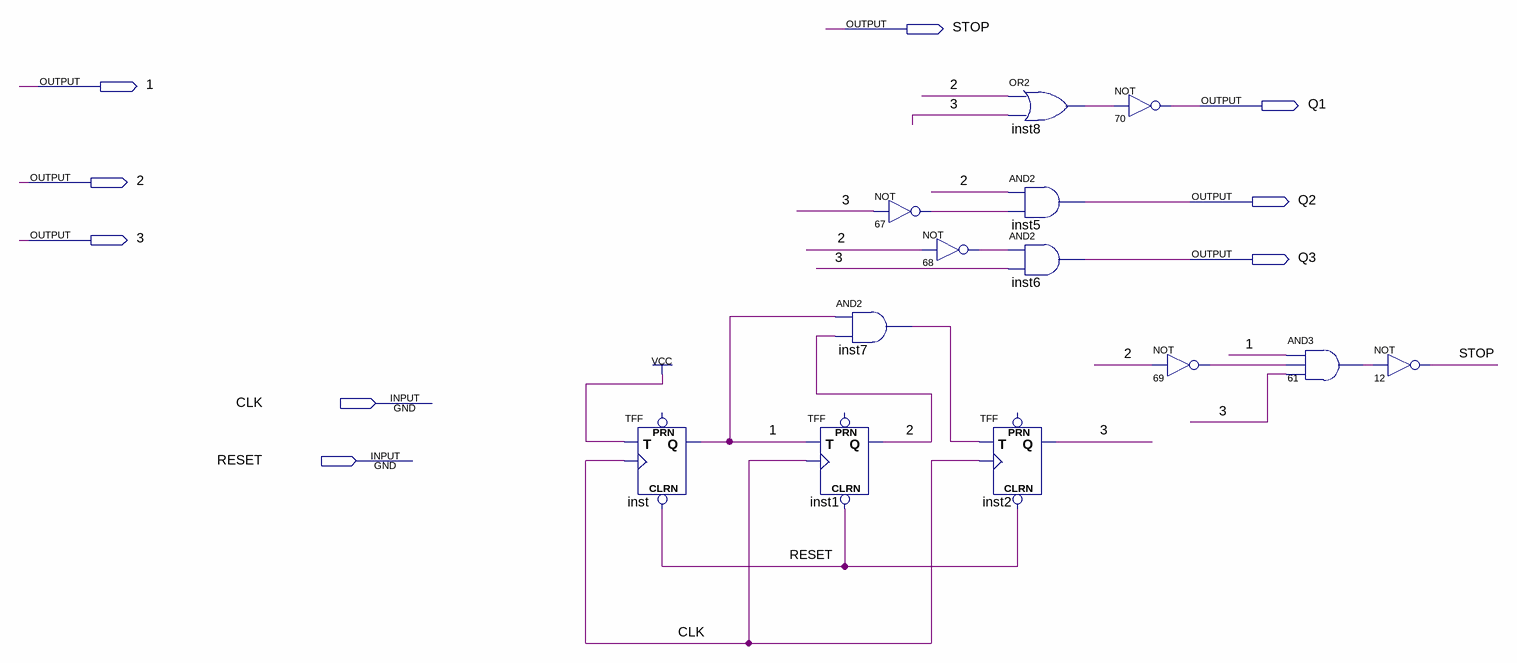
[diagram p0: schematic sheet]
// Quartus schematic proba_2des.bdf as structural Verilog: 13 symbols, 9 pins
module proba_2des (
  input  CLK,
  input  RESET,
  output STOP,
  output \1 ,
  output Q1,
  output \2 ,
  output Q2,
  output \3 ,
  output Q3
);

  wire inst7_out, inst8_out, n61_out, n67_out, n68_out, n69_out;

  TFF inst (.CLRN(RESET), .T(1'b1), .CLK(CLK), .Q(\1 ));  // open: PRN
  and inst7 (inst7_out, \1 , \2 );
  TFF inst1 (.CLRN(RESET), .T(\1 ), .CLK(CLK), .Q(\2 ));  // open: PRN
  not u_67 (n67_out, \3 );
  not u_68 (n68_out, \2 );
  TFF inst2 (.CLRN(RESET), .T(inst7_out), .CLK(CLK), .Q(\3 ));  // open: PRN
  or inst8 (inst8_out, \2 , \3 );
  and inst5 (Q2, \2 , n67_out);
  and inst6 (Q3, n68_out, \3 );
  not u_70 (Q1, inst8_out);
  not u_69 (n69_out, \2 );
  and u_61 (n61_out, \1 , n69_out, \3 );
  not u_12 (STOP, n61_out);
endmodule
